# EAGLE schematic PandN (EAGLE 5.10)
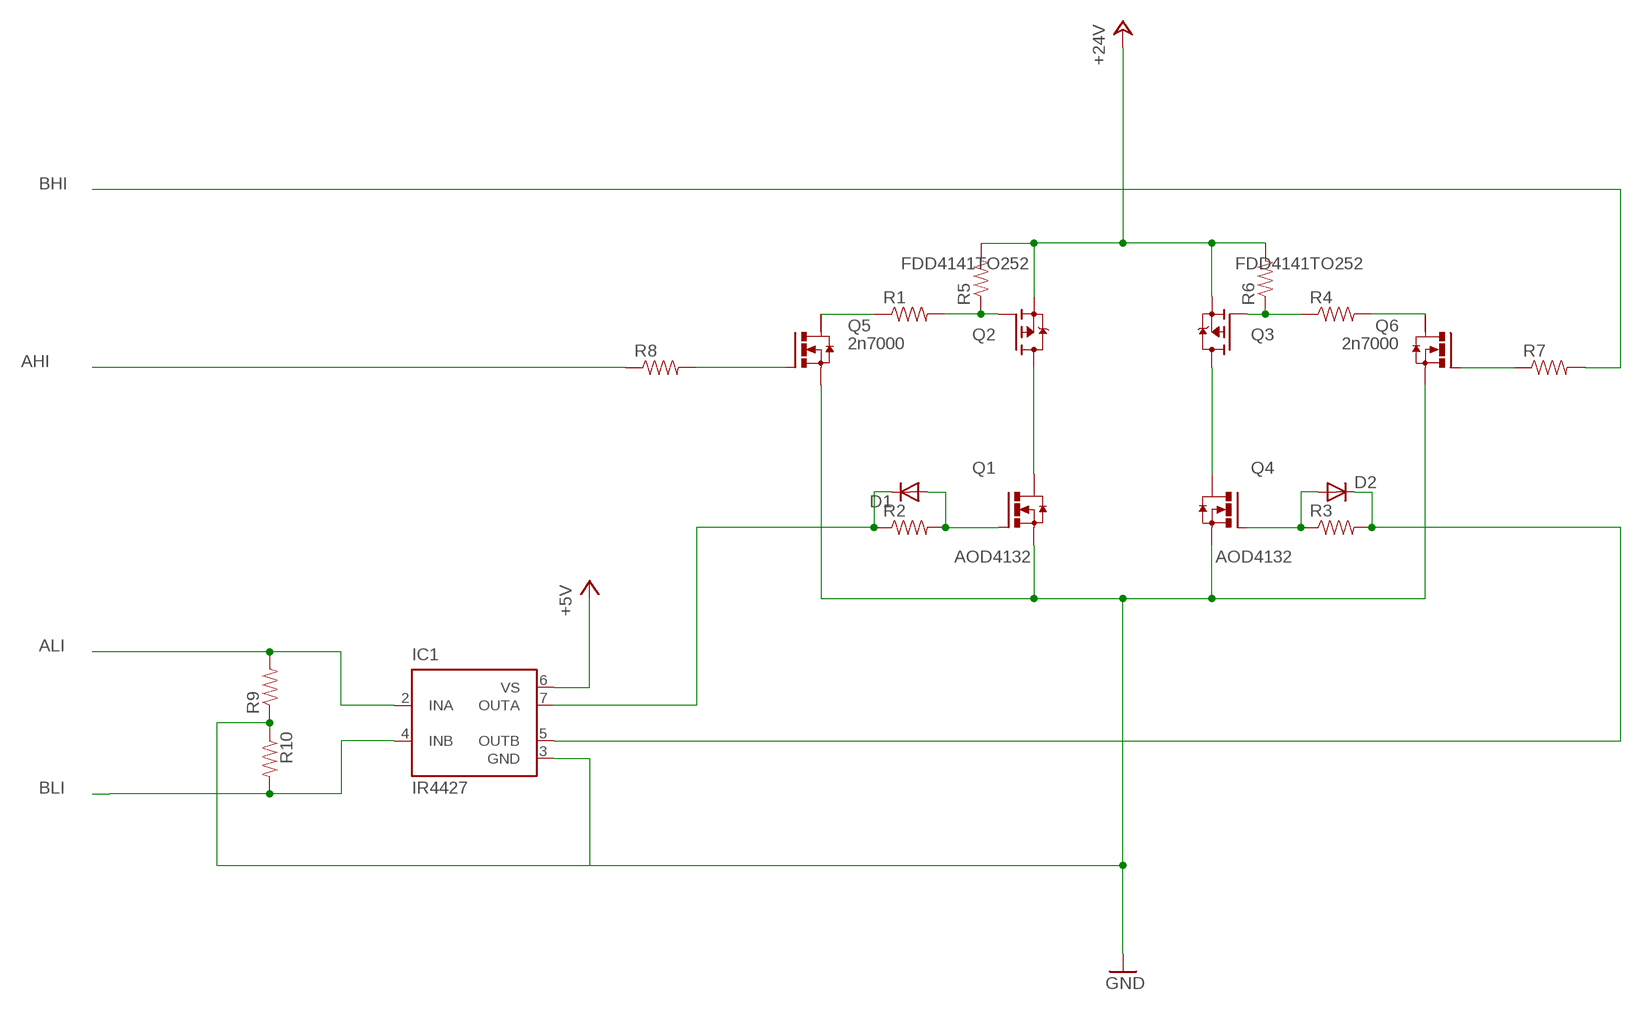
[diagram p0: schematic, sheet 1]

## Parts
D1  DIODESMA  [SMA-DIODE]
D2  DIODESMA  [SMA-DIODE]
IC1  IR4427  [DIL08]
Q1  AOD4132  IRF3704S  [D2PACK]
Q2  FDD4141TO252  [TO252]
Q3  FDD4141TO252  [TO252]
Q4  AOD4132  IRF3704S  [D2PACK]
Q5  2n7000  N-HEXFET-2D_SOT232-IRLL014N  [SOT223]
Q6  2n7000  N-HEXFET-2D_SOT232-IRLL014N  [SOT223]
R1  RESISTOR1206  [1206]
R2  RESISTOR1206  [1206]
R3  RESISTOR1206  [1206]
R4  RESISTOR1206  [1206]
R5  RESISTOR1206  [1206]
R6  RESISTOR1206  [1206]
R7  RESISTOR1206  [1206]
R8  RESISTOR1206  [1206]
R9  RESISTOR1206  [1206]
R10  RESISTOR1206  [1206]

## Nets
+5V: IC1.6(VS)
+24V: Q2.3(S) Q3.3(S) R5.2 R6.2
AHI: R8.1
ALI: IC1.2(INA) R9.2
BHI: R7.2
BLI: IC1.4(INB) R10.2
GND: Q1.3(S) Q4.3(S) Q5.3(S) Q6.3(S)
N$1: Q1.2(D) Q2.2(D)
N$2: Q3.2(D) Q4.2(D)
N$5: Q2.1(G) R1.2 R5.1
N$6: D1.A Q1.1(G) R2.2
N$7: D2.A Q4.1(G) R3.1
N$8: Q3.1(G) R4.1 R6.1
N$9: Q5.2(D) R1.1
N$10: Q6.2(D) R4.2
N$12: D2.C IC1.5(OUTB) R3.2
N$13: D1.C IC1.7(OUTA) R2.1
N$16: Q5.1(G) R8.2
N$17: Q6.1(G) R7.1
N$19: IC1.3(GND) R9.1 R10.1
Unconnected: Q5.4(D) Q6.4(D)

## Library data of the parts
D1 D2 = SparkFun:DIODE: Diode These are standard reverse protection diodes and small signal diodes. SMA package can handle up to about 1A. SOD-323 can handle about 200mA. What the SOD-323 package when ordering, there are some mfgs out there that are 5-pin packages.
IC1 = ir:IR4427: DUAL LOW SIDE DRIVER Source: ID4426.pdf
Q1 Q4 = transistor-power:IRF3704: SMPS MOSFET HEXFET® Power MOSFET Source: http://www.irf.com/product-info/datasheets/data/irf3704.pdf
Q2 Q3 = transistor-fet:FDD4141: P-Channel PowerTrench® MOSFET Source: FDD4141.pdf
Q5 Q6 = transistor-power:N-HEXFET-2D_?-*: HEXFET® Power MOSFET 2 Drain connects http://www.irf.com/product-info/datasheets/data/irll014n.pdf
R1-R10 = SparkFun:RESISTOR: Resistor Basic schematic elements and footprints for 0603, 1206, and PTH 1/10th watt (small) resistors.